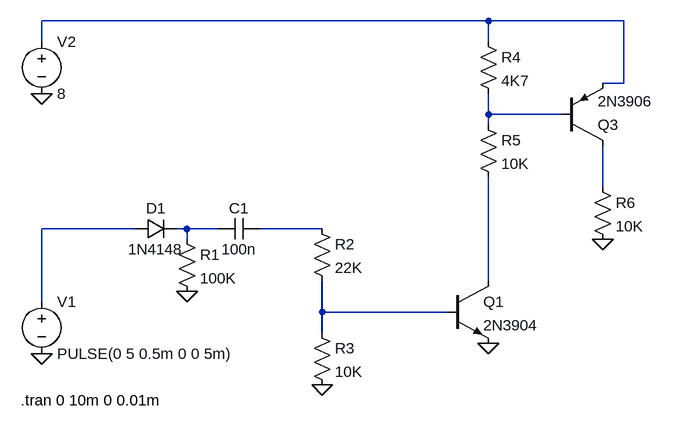
[diagram p0: schematic trigger.asc]
trigger.asc, the LTspice schematic file:
Version 4
SHEET 1 932 680
WIRE 640 -208 -48 -208
WIRE 848 -208 640 -208
WIRE -48 -176 -48 -208
WIRE 640 -176 640 -208
WIRE 848 -112 848 -208
WIRE 848 -112 816 -112
WIRE 640 -64 640 -96
WIRE 752 -64 640 -64
WIRE 640 -48 640 -64
WIRE 816 48 816 -16
WIRE 96 112 -48 112
WIRE 176 112 160 112
WIRE 224 112 176 112
WIRE 384 112 288 112
WIRE 176 128 176 112
WIRE 640 192 640 32
WIRE -48 224 -48 112
WIRE 384 240 384 192
WIRE 576 240 384 240
WIRE 384 272 384 240
FLAG 176 208 0
FLAG 384 352 0
FLAG 640 288 0
FLAG -48 -96 0
FLAG -48 304 0
FLAG 816 128 0
SYMBOL diode 96 128 R270
WINDOW 0 32 32 VTop 2
WINDOW 3 0 32 VBottom 2
SYMATTR InstName D1
SYMATTR Value 1N4148
SYMBOL res 160 112 R0
SYMATTR InstName R1
SYMATTR Value 100K
SYMBOL cap 288 96 R90
WINDOW 0 0 32 VBottom 2
WINDOW 3 32 32 VTop 2
SYMATTR InstName C1
SYMATTR Value 100n
SYMBOL res 368 96 R0
SYMATTR InstName R2
SYMATTR Value 22K
SYMBOL res 368 256 R0
SYMATTR InstName R3
SYMATTR Value 10K
SYMBOL res 624 -192 R0
SYMATTR InstName R4
SYMATTR Value 4K7
SYMBOL res 624 -64 R0
SYMATTR InstName R5
SYMATTR Value 10K
SYMBOL npn 576 192 R0
SYMATTR InstName Q1
SYMATTR Value 2N3904
SYMBOL pnp 752 -16 M180
SYMATTR InstName Q3
SYMATTR Value 2N3906
SYMBOL res 800 32 R0
SYMATTR InstName R6
SYMATTR Value 10K
SYMBOL voltage -48 208 R0
WINDOW 123 0 0 Left 0
WINDOW 39 0 0 Left 0
SYMATTR InstName V1
SYMATTR Value PULSE(0 5 0.5m 0 0 5m)
SYMBOL voltage -48 -192 R0
WINDOW 123 0 0 Left 0
WINDOW 39 0 0 Left 0
SYMATTR InstName V2
SYMATTR Value 8
TEXT -80 376 Left 2 !.tran 0 10m 0 0.01m

The netlist it stands for:
* trigger.asc
D1 N004 N005 1N4148
R1 N005 0 100K
C1 N006 N005 100n
R2 N006 N008 22K
R3 N008 0 10K
R4 N001 N002 4K7
R5 N002 N007 10K
Q1 N007 N008 0 0 2N3904
Q3 N003 N002 N001 0 2N3906
R6 N003 0 10K
V1 N004 0 PULSE(0 5 0.5m 0 0 5m)
V2 N001 0 8
.model D D
.lib standard.dio
.model NPN NPN
.model PNP PNP
.lib standard.bjt
.tran 0 10m 0 0.01m
.backanno
.end